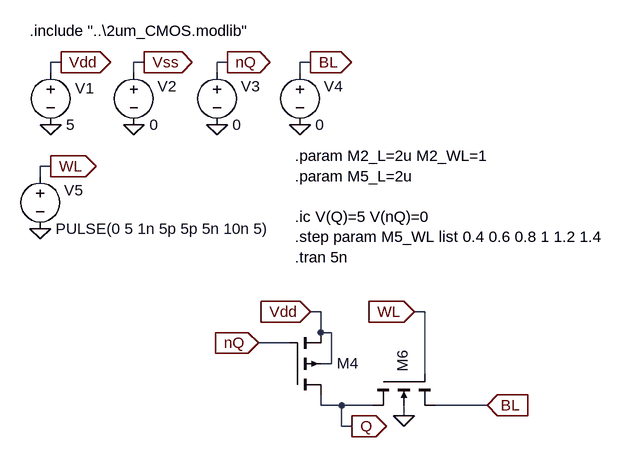
[diagram p0: schematic half-core-escritura.asc]
half-core-escritura.asc, the LTspice schematic file:
Version 4
SHEET 1 1180 1172
WIRE -608 -272 -624 -272
WIRE -480 -272 -496 -272
WIRE -352 -272 -368 -272
WIRE -224 -272 -240 -272
WIRE -624 -256 -624 -272
WIRE -496 -256 -496 -272
WIRE -368 -256 -368 -272
WIRE -240 -256 -240 -272
WIRE -624 -112 -640 -112
WIRE -640 -96 -640 -112
WIRE -208 112 -224 112
WIRE -48 112 -64 112
WIRE -208 144 -208 112
WIRE -192 144 -208 144
WIRE -256 160 -304 160
WIRE -192 192 -192 144
WIRE -192 192 -208 192
WIRE -48 208 -48 112
WIRE -208 256 -208 240
WIRE -176 256 -208 256
WIRE -128 256 -176 256
WIRE 48 256 -32 256
WIRE -80 272 -80 256
WIRE -176 288 -176 256
WIRE -160 288 -176 288
FLAG 48 256 BL
IOPIN 48 256 In
FLAG -64 112 WL
IOPIN -64 112 In
FLAG -224 112 Vdd
IOPIN -224 112 In
FLAG -160 288 Q
IOPIN -160 288 Out
FLAG -80 272 0
FLAG -624 -176 0
FLAG -608 -272 Vdd
IOPIN -608 -272 Out
FLAG -496 -176 0
FLAG -480 -272 Vss
IOPIN -480 -272 Out
FLAG -368 -176 0
FLAG -352 -272 nQ
IOPIN -352 -272 Out
FLAG -240 -176 0
FLAG -224 -272 BL
IOPIN -224 -272 Out
FLAG -640 -16 0
FLAG -624 -112 WL
IOPIN -624 -112 Out
FLAG -304 160 nQ
IOPIN -304 160 In
SYMBOL pmos4 -256 240 M180
WINDOW 0 73 49 Left 2
WINDOW 3 55 45 Invisible 2
SYMATTR InstName M4
SYMATTR Value P_2u
SYMATTR Value2 l={M2_L} w={M2_L * M2_WL}
SYMBOL nmos4 -128 208 M90
WINDOW 0 -37 46 Left 2
WINDOW 3 -70 42 Invisible 2
SYMATTR InstName M6
SYMATTR Value N_2u
SYMATTR Value2 l={M5_L} w={M5_L * M5_WL}
SYMBOL voltage -624 -272 R0
WINDOW 0 38 40 Left 2
SYMATTR InstName V1
SYMATTR Value 5
SYMBOL voltage -496 -272 R0
WINDOW 0 37 37 Left 2
SYMATTR InstName V2
SYMATTR Value 0
SYMBOL voltage -368 -272 R0
WINDOW 0 37 37 Left 2
WINDOW 123 0 0 Left 0
WINDOW 39 0 0 Left 0
SYMATTR InstName V3
SYMATTR Value 0
SYMBOL voltage -240 -272 R0
WINDOW 0 37 37 Left 2
SYMATTR InstName V4
SYMATTR Value 0
SYMBOL voltage -640 -112 R0
WINDOW 0 37 37 Left 2
SYMATTR InstName V5
SYMATTR Value PULSE(0 5 1n 5p 5p 5n 10n 5)
TEXT -656 -320 Left 2 !.include "..\\2um_CMOS.modlib"
TEXT -248 -128 Left 2 !.param M2_L=2u M2_WL=1\n.param M5_L=2u\n \n.ic V(Q)=5 V(nQ)=0\n.step param M5_WL list 0.4 0.6 0.8 1 1.2 1.4\n.tran 5n

The netlist it stands for:
* half-core-escritura.asc
M4 Q nQ Vdd Vdd P_2u l={M2_L} w={M2_L * M2_WL}
M6 Q WL BL 0 N_2u l={M5_L} w={M5_L * M5_WL}
V1 Vdd 0 5
V2 Vss 0 0
V3 nQ 0 0
V4 BL 0 0
V5 WL 0 PULSE(0 5 1n 5p 5p 5n 10n 5)
.model NMOS NMOS
.model PMOS PMOS
.lib standard.mos
.include "..\2um_CMOS.modlib"
.param M2_L=2u M2_WL=1
.param M5_L=2u
.ic V(Q)=5 V(nQ)=0
.step param M5_WL list 0.4 0.6 0.8 1 1.2 1.4
.tran 5n
.backanno
.end